# EAGLE design Extruder_1 Board (EAGLE 9.1.3)
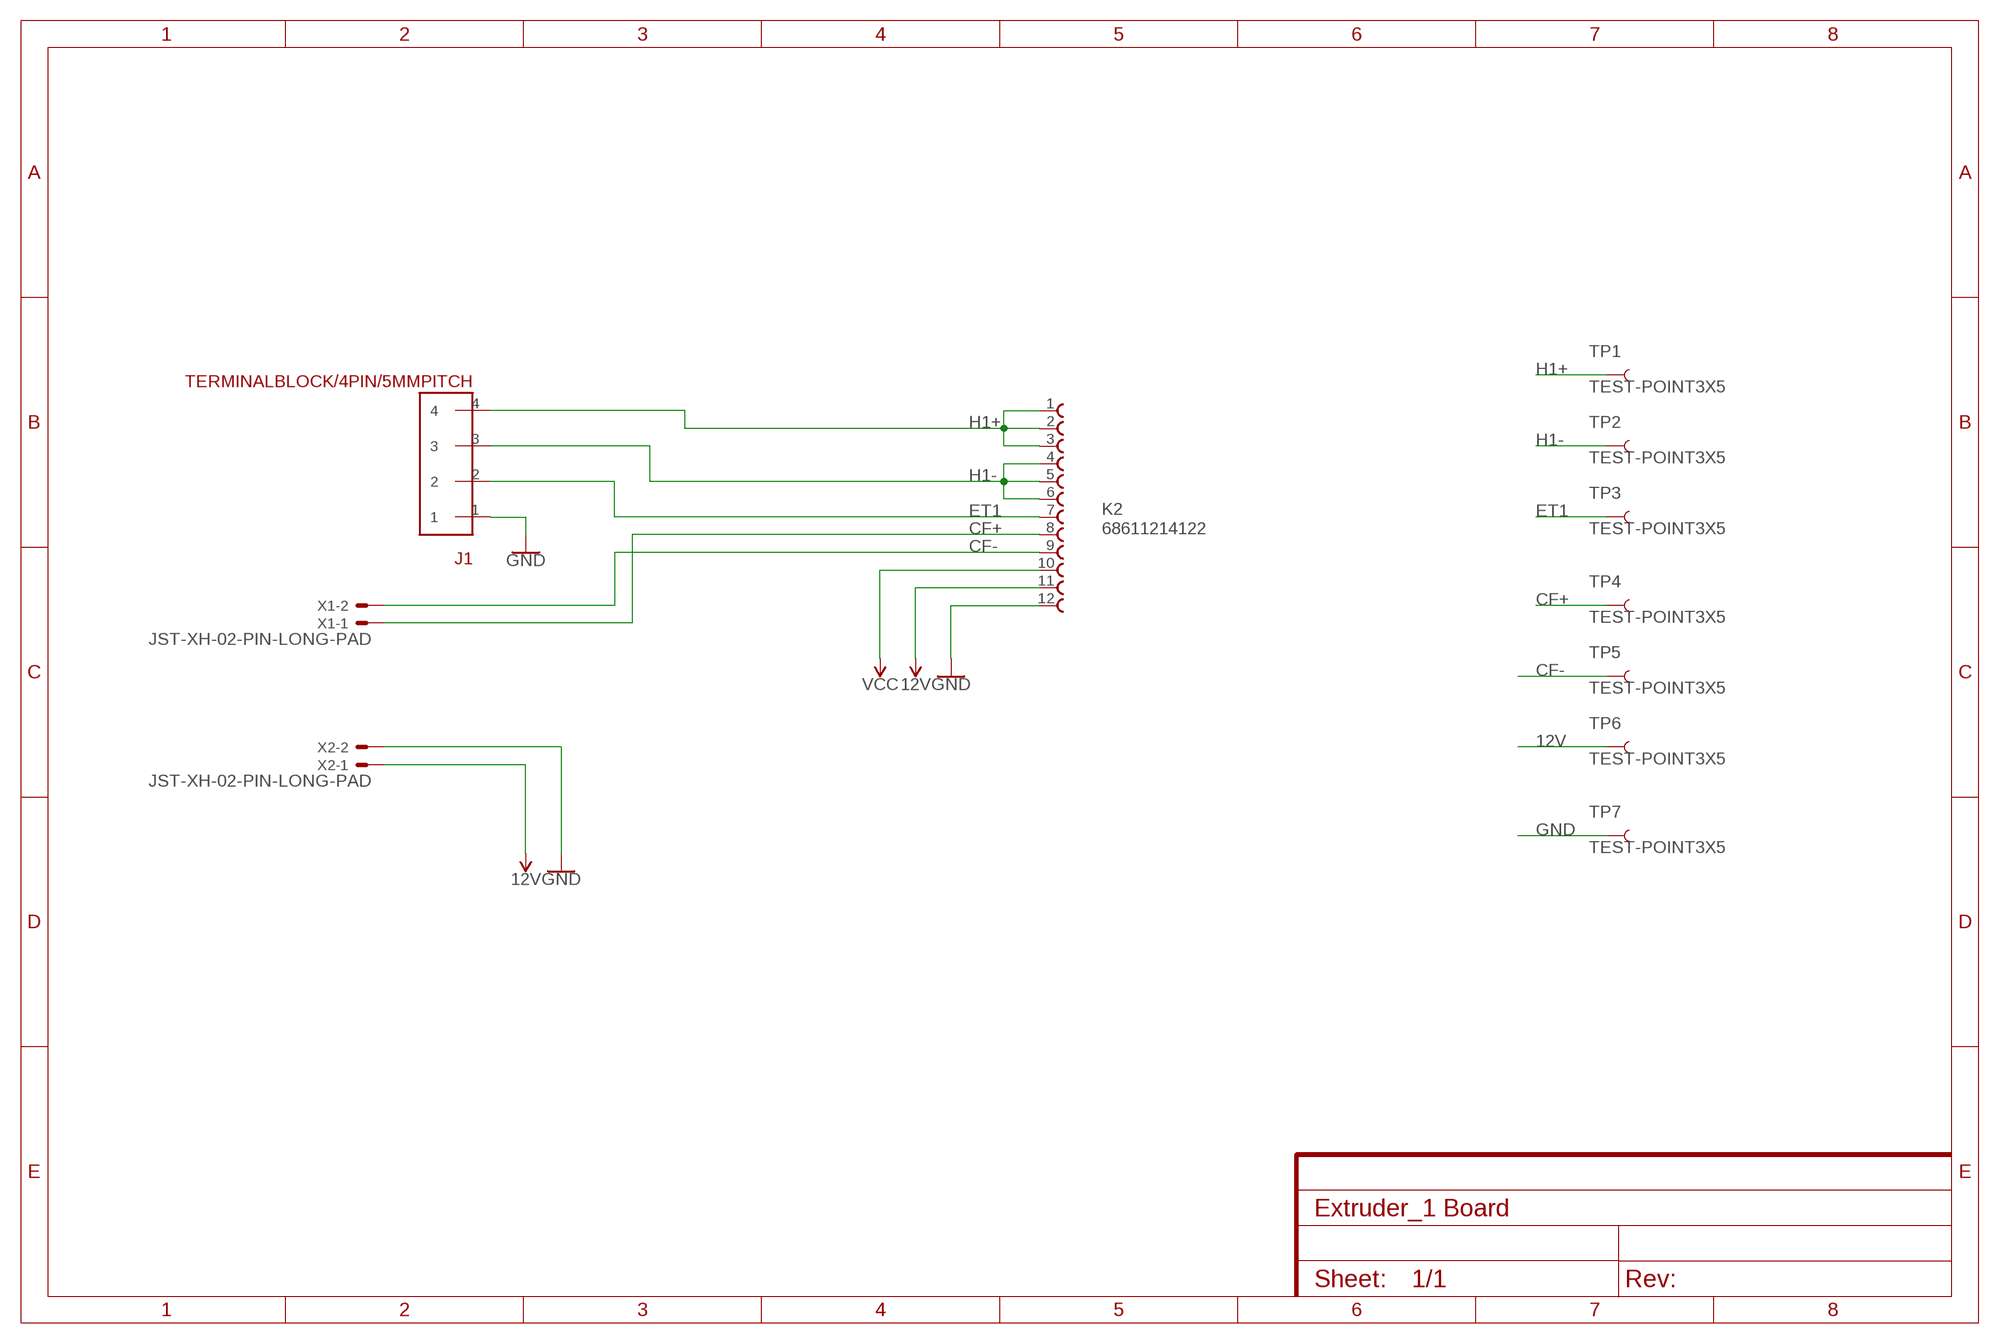
[diagram p0: schematic, sheet 1]

## Parts
J1  TERMINALBLOCK/4PIN/5MMPITCH  [TERMINALBLOCK/TOYO/4PIN/5MMPITCH]
K2  68611214122  [68611214122]
TP1  TEST-POINT3X5  [PAD.03X.05]
TP2  TEST-POINT3X5  [PAD.03X.05]
TP3  TEST-POINT3X5  [PAD.03X.05]
TP4  TEST-POINT3X5  [PAD.03X.05]
TP5  TEST-POINT3X5  [PAD.03X.05]
TP6  TEST-POINT3X5  [PAD.03X.05]
TP7  TEST-POINT3X5  [PAD.03X.05]
X1  JST-XH-02-PIN-LONG-PAD  [JST-XH-02-PACKAGE-LONG-PAD]
X2  JST-XH-02-PIN-LONG-PAD  [JST-XH-02-PACKAGE-LONG-PAD]

## Nets
12V: K2.11 TP6.P$1 X2.1
CF+: K2.8 TP4.P$1 X1.1
CF-: K2.9 TP5.P$1 X1.2
ET1: J1.2 K2.7 TP3.P$1
GND: J1.1 K2.12 TP7.P$1 X2.2
H1+: J1.4 K2.1 K2.2 K2.3 TP1.P$1
H1-: J1.3 K2.4 K2.5 K2.6 TP2.P$1
VCC: K2.10

## Library data of the parts
J1 = FracktalWorks_Eagle_Library:TERMINALBLOCK/4PIN/5MMPITCH
K2 = Wurth_Elektronik_Electromechanic_FPC_Connectors_&_Flat_Flexible_Cable_rev15b:68611214122: WR-FPC 1.00mm SMT ZIF Horizontal Top Contact, 12 Pins=>Code : Con_FPC_ZIF_1.00_68611214122 <http://katalog.we-online.de/media/images/eican/Con_FPC_ZIF_1.00_6861xx14122_pf2.jpg> Details see: http://katalog.we-online.de/en/em/686_1xx_141_22 Created 2014-07-09, Karrer Zheng 2014 (C) Würth Elektronik
TP1-TP7 = SparkFun-Connectors:TEST-POINT: SparkFun Test Points Bare copper test points for troubleshooting or In-Circuit-Testing. These are used by our Production team for verifying production board runs using pogo-pins on test beds. SparkFun Products: SparkFun LSM9DS1 Breakout <https://www.sparkfun.com/products/13284> SparkFun PSOC <https://www.sparkfun.com/products/13714> SparkFun Load Cell Amplifier <https://www.sparkfun.com/products/13879>
X1 X2 = Rembrandt Electronics - JST XH Connectors v1-0:JST-XH-02-PIN: JST XH Connector 2 Pin Wire to board connector. Pitch: 2,54 mm, (0.100") Number of pins: 2 Created by Rembrandt Electronics www.rembrandtelectronics.com

## Board
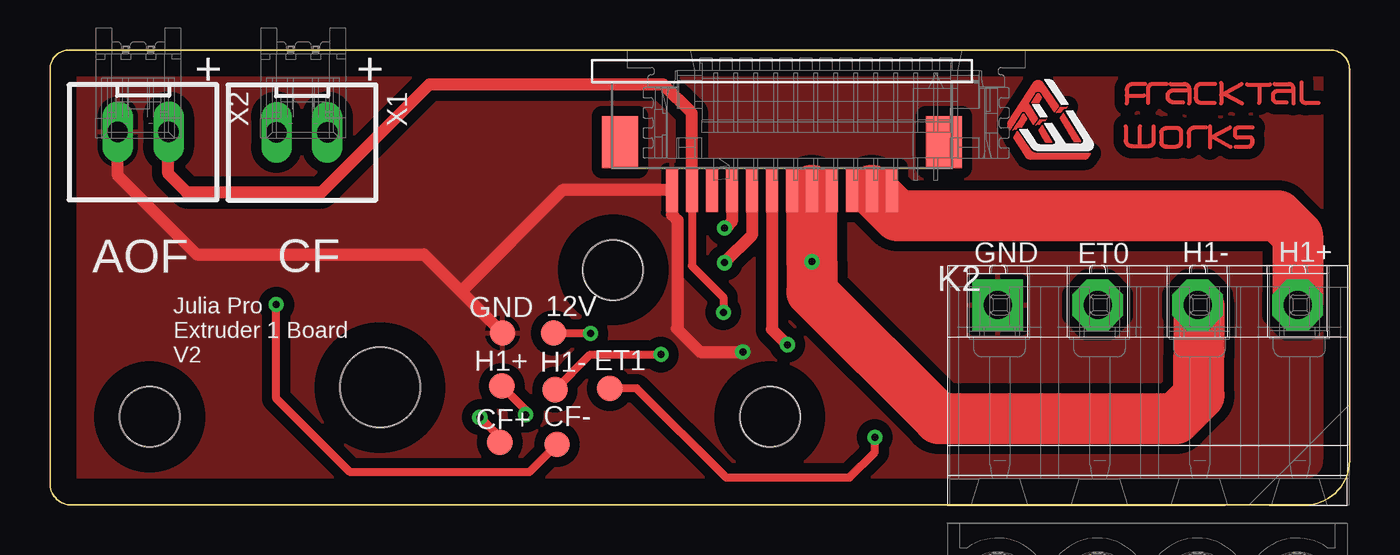
[diagram p1: board, top side]
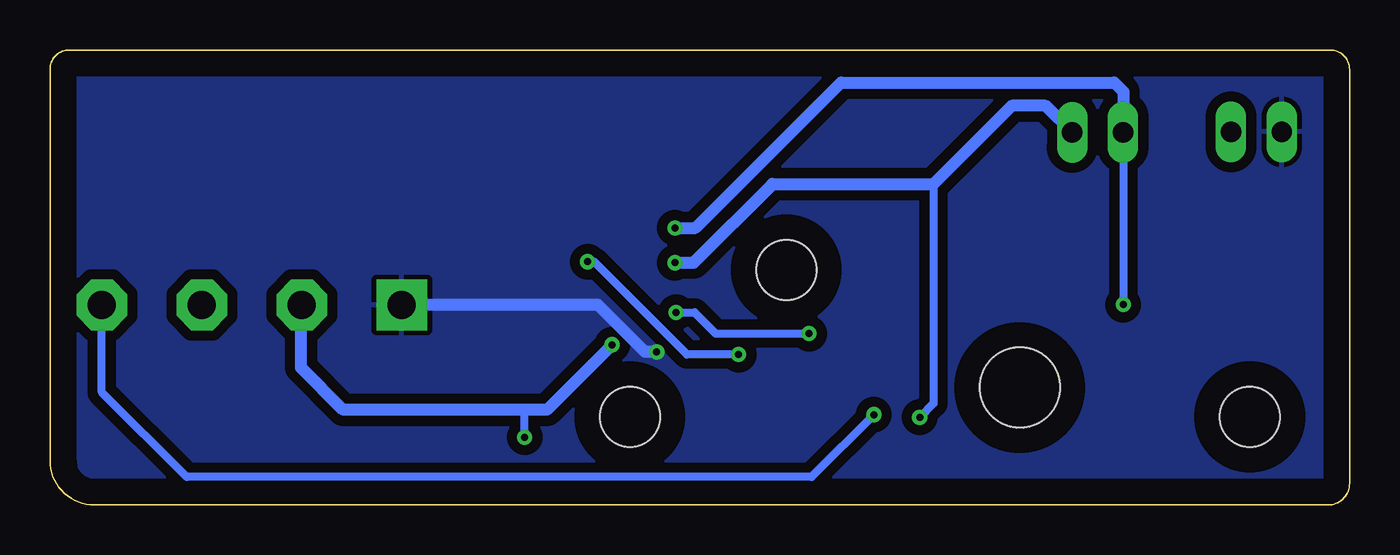
[diagram p2: board, bottom side, seen from below]

Size 65 x 22.77 mm. Coordinates in mm from the lower left corner, seen from the top.
Outline: 0.98,22.77 64.03,22.77 arc-90 65,21.8 65,2.22 arc-90 62.78,0 1.07,0 arc-90 0,1.07 0,21.79 arc-90 0.98,22.77
Copper layers (1*16): Top 0.035mm / dielectric 1.5mm / Bottom 0.035mm
Design rules "LionCircuits": minimum track width 8mil, minimum drill 0.35mm, track to track 8mil, track to pad 8mil, pad to pad 8mil, via to via 8mil, smd to smd 8mil, copper to edge 50mil, drill to drill 10mil, minimum pad ring 10mil, minimum via ring 8mil, stop-mask expansion 4mil, vias tented up to drill 0mil, thermal gap 10mil
Holes 4 mm at 16.5,5.87
Holes 3 mm at 4.99,4.4 36,4.4 28.17,11.77

### Footprints (pad centres in the part's own frame; a part is rotated, then mirrored left to right if it is on the bottom)
TERMINALBLOCK/TOYO/4PIN/5MMPITCH = drill 1.4 pad 2.54 square: 1 0,0 | drill 1.4 pad 2.54 octagon: 2 5,0; 3 10,0; 4 15,0
68611214122 = smd 0.6 x 2.2: 1 -8.5,1.1; 2 -7.5,1.1; 3 -6.5,1.1; 4 -5.5,1.1; 5 -4.5,1.1; 6 -3.5,1.1; 7 -2.5,1.1; 8 -1.5,1.1; 9 -0.5,1.1; 10 0.5,1.1; 11 1.5,1.1; 12 2.5,1.1 | smd 1.8 x 2.6: Z1 -11.1,-1.3; Z2 5.1,-1.3
PAD.03X.05 = smd 1.27 x 1.27: P$1 0,0
JST-XH-02-PACKAGE-LONG-PAD = drill 1.016 long: 1 -1.27,0; 2 1.27,0

### Placement (x,y rotation side)
J1  47.4,10.01 0 top
K2  33.61,16.85 180 top
TP1  22.6,5.96 0 top
TP2  25.26,5.77 0 top
TP3  28,5.84 0 top
TP4  22.5,3.13 0 top
TP5  25.36,3.03 0 top
TP6  25.18,8.61 0 top
TP7  22.64,8.61 0 top
U$1  FWLOGO_SMALL_FOOTPRINT  [FWLOGO_SMALL]  47.66,16.14 0 top
X1  12.6,18.65 180 top
X2  4.66,18.67 180 top

### Tracks (layer width: path | path; a pad name or v marks a point on that pad's centre or on a via)
12V  (via drill 0.35)
  Top 0.406: K2.11 32.11,11.96 33.68,10.39 v33.68,9.64 | v27.03,8.58 25.21,8.58 TP6.P$1
  Top 0.61: K2.11 32.11,19.6 30.67,21.04 18.97,21.04 13.56,15.63 6.86,15.63 5.92,16.57 X2.1
  Bottom 0.406: v27.03,8.58 31.7,8.58 32.76,9.64 v33.68,9.64
CF+  (via drill 0.35)
  Top 0.406: v21.5,4.39 22.5,3.39 TP4.P$1
  Top 0.61: K2.8 35.11,13.49 v33.74,12.12
  Bottom 0.406: 20.81,16.06 20.81,5.08 v21.5,4.39
  Bottom 0.61: v33.74,12.12 32.81,12.12 28.87,16.06 20.81,16.06 16.89,19.98 15.2,19.98 X1.1
CF-  (via drill 0.35)
  Top 0.406: TP5.P$1 23.96,1.63 15.02,1.63 11.32,5.33 v11.32,10.03
  Top 0.61: K2.9 34.11,14.17 33.8,13.86 v33.74,13.86
  Bottom 0.406: v11.32,10.03 X1.2
  Bottom 0.61: v33.74,13.86 32.72,13.86 25.44,21.14 11.77,21.14 11.31,20.68 11.31,18.67 X1.2
ET1  (via drill 0.35)
  Top 0.406: v41.26,3.39 41.26,2.64 39.99,1.37 33.82,1.37 29.35,5.84 TP3.P$1
  Top 0.61: K2.7 36.11,8.79 v36.88,8.02
  Bottom 0.406: v41.26,3.39 41.26,4.76
  Bottom 0.61: v36.88,8.02 40.14,4.76 41.26,4.76 50.33,4.76 52.44,6.87 52.44,9.97 J1.2
GND  (via drill 0.35)
  Top 0.61: v34.65,7.66 32.51,7.66 31.35,8.82 31.4,8.87 31.4,14.24 31.11,14.53 K2.12 25.62,15.75 20.56,10.69 | 20.56,10.69 18.71,12.54 7.33,12.54 3.39,16.48 X2.2 | 20.56,10.69 TP7.P$1
  Bottom 0.61: J1.1 37.59,10.01 35.24,7.66 v34.65,7.66
  pour Top (isolate 0.508): 0.31,22.5 64.31,22.5 64.31,0.65 0.3,0.65 0.3,22.51
  pour Bottom (isolate 0.508): 0.42,22.54 64.39,22.54 64.39,0.79 0.4,0.79 0.4,22.55
H1+  (via drill 0.35)
  Top 0.406: K2.3 K2.1 K2.2 | TP1.P$1 23.79,4.77 v23.79,4.52
  Top 2.54: K2.2 42.39,14.47 61.42,14.47 62.4,13.49 J1.4
  Bottom 0.406: v23.79,4.52 26.91,1.4 58.16,1.4 62.4,5.64 J1.4
H1-  (via drill 0.35)
  Top 0.406: K2.4 K2.5 K2.6 | TP2.P$1 27.02,7.53 v30.56,7.53
  Top 2.54: K2.5 v38.11,12.17 38.11,10.66 44.45,4.32 56.3,4.32 57.47,5.49 57.47,7.54 57.47,9.94 J1.3
  Bottom 0.406: v30.56,7.53 33.14,7.53 37.78,12.17 v38.11,12.17

### Text on the board
tPlace: + | + | GND | ET0 | H1- | H1+ | AOF | CF | GND | 12V | Julia Pro / Extruder 1 Board / V2 | H1+ | H1- | ET1 | CF+ | CF-